# EAGLE schematic cmos-guy (EAGLE 7.5.0)
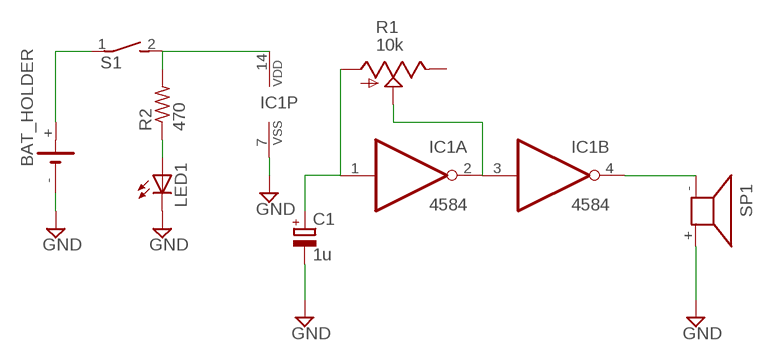
[diagram p0: schematic, sheet 1]

## Parts
BAT_HOLDER  CH291-1220LF  [CH291-1220LF]
C1  1u  CPOL-EUE2.5-5  [E2,5-5]
IC1  4584  4584N  [DIL14]
LED1  LBP4-BOTTOM  [P47F-BOTTOM]
R1  10k  TRIM_US-RJ6S  [RJ6S]
R2  470  R-US_0204/5  [0204/5]
S1  DS01E  [DS-01]
SP1  AL11P  [AL11P]

## Nets
GND: BAT_HOLDER.- C1.- IC1.7(P:VSS) LED1.C SP1.+
N$1: C1.+ IC1.1(A:I) R1.A
N$2: IC1.2(A:O) IC1.3(B:I) R1.S
N$3: BAT_HOLDER.+ S1.1
N$4: IC1.4(B:O) SP1.-
N$5: IC1.14(P:VDD) R2.2 S1.2
N$6: LED1.A R2.1
Unconnected: IC1.5(C:I) IC1.6(C:O) IC1.8(D:O) IC1.9(D:I) IC1.10(E:O) IC1.11(E:I) IC1.12(F:O) IC1.13(F:I) R1.E

## Library data of the parts
BAT_HOLDER = battery:CH291-1220LF: Battery Holder, SMT, 12mm multicomp PART NO. CH291-1220LF Source: Data sheet <http://www.farnell.com/datasheets/1505860.pdf>
C1 = rcl:CPOL-EU: POLARIZED CAPACITOR, European symbol
IC1 = 45xx:4584: Hex SCHMITT TRIGGER (74C14)
LED1 = led:*P4: PointLED® Enhanced Thinfilm LED TOP & BOTTOM mount LS P47F, LR P47F, LA P47F, LY P47F, LT P4SG, LB P4SG, LW P4SG Source: http://catalog.osram-os.com .. LA_LR_LS_LY_P47F_Pb_free.pdf
R1 = pot:TRIM_US-: POTENTIOMETER
R2 = resistor:R-US_: RESISTOR, American symbol
S1 = switch-dil:DS01E: DIL/CODE SWITCH; OC_FARNELL: unknown; OC_NEWARK: unknown
SP1 = buzzer:AL11P: SPEAKER Source: Buerklin; OC_FARNELL: unknown; OC_NEWARK: unknown